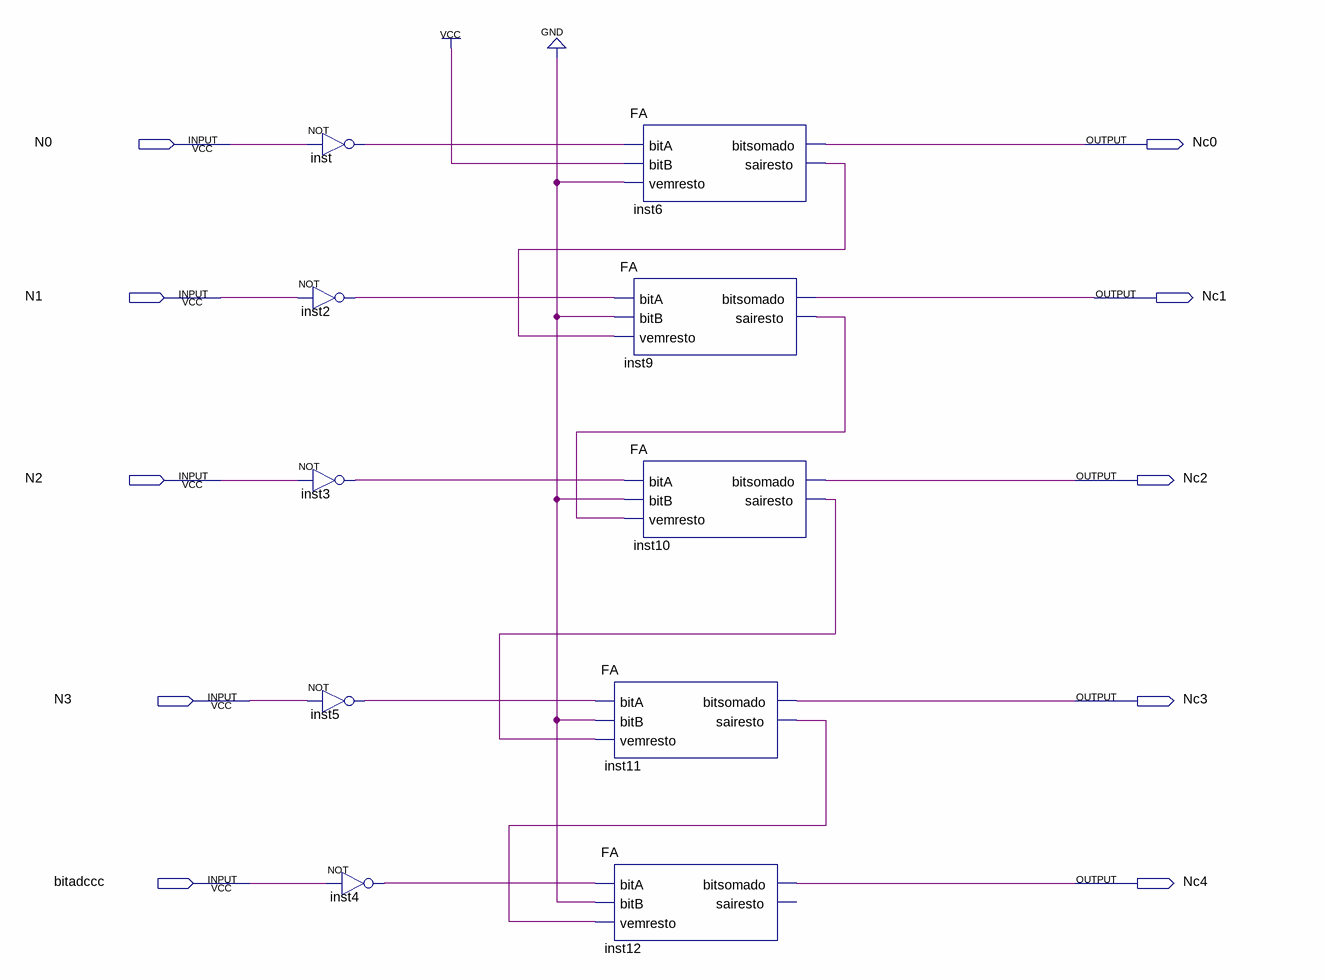
[diagram p0: schematic sheet]
// Quartus schematic complemento2parasoma.bdf as structural Verilog: 10 symbols, 10 pins
module complemento2parasoma (
  input  N0,
  input  N1,
  input  N2,
  input  N3,
  input  bitadccc,
  output Nc0,
  output Nc1,
  output Nc2,
  output Nc3,
  output Nc4
);

  wire inst2_out, inst3_out, inst4_out, inst5_out, inst6_sairesto, inst9_sairesto, inst10_sairesto,
       inst11_sairesto, inst_out;

  not inst (inst_out, N0);
  not inst2 (inst2_out, N1);
  not inst3 (inst3_out, N2);
  not inst5 (inst5_out, N3);
  not inst4 (inst4_out, bitadccc);
  FA inst6 (.bitA(inst_out), .bitB(1'b1), .vemresto(1'b0), .bitsomado(Nc0), .sairesto(inst6_sairesto));
  FA inst9 (.bitA(inst2_out), .bitB(1'b0), .vemresto(inst6_sairesto), .bitsomado(Nc1), .sairesto(inst9_sairesto));
  FA inst10 (.bitA(inst3_out), .bitB(1'b0), .vemresto(inst9_sairesto), .bitsomado(Nc2), .sairesto(inst10_sairesto));
  FA inst11 (.bitA(inst5_out), .bitB(1'b0), .vemresto(inst10_sairesto), .bitsomado(Nc3), .sairesto(inst11_sairesto));
  FA inst12 (.bitA(inst4_out), .bitB(1'b0), .vemresto(inst11_sairesto), .bitsomado(Nc4));  // open: sairesto
endmodule
